# EAGLE design lightbird (EAGLE 8.4.3)
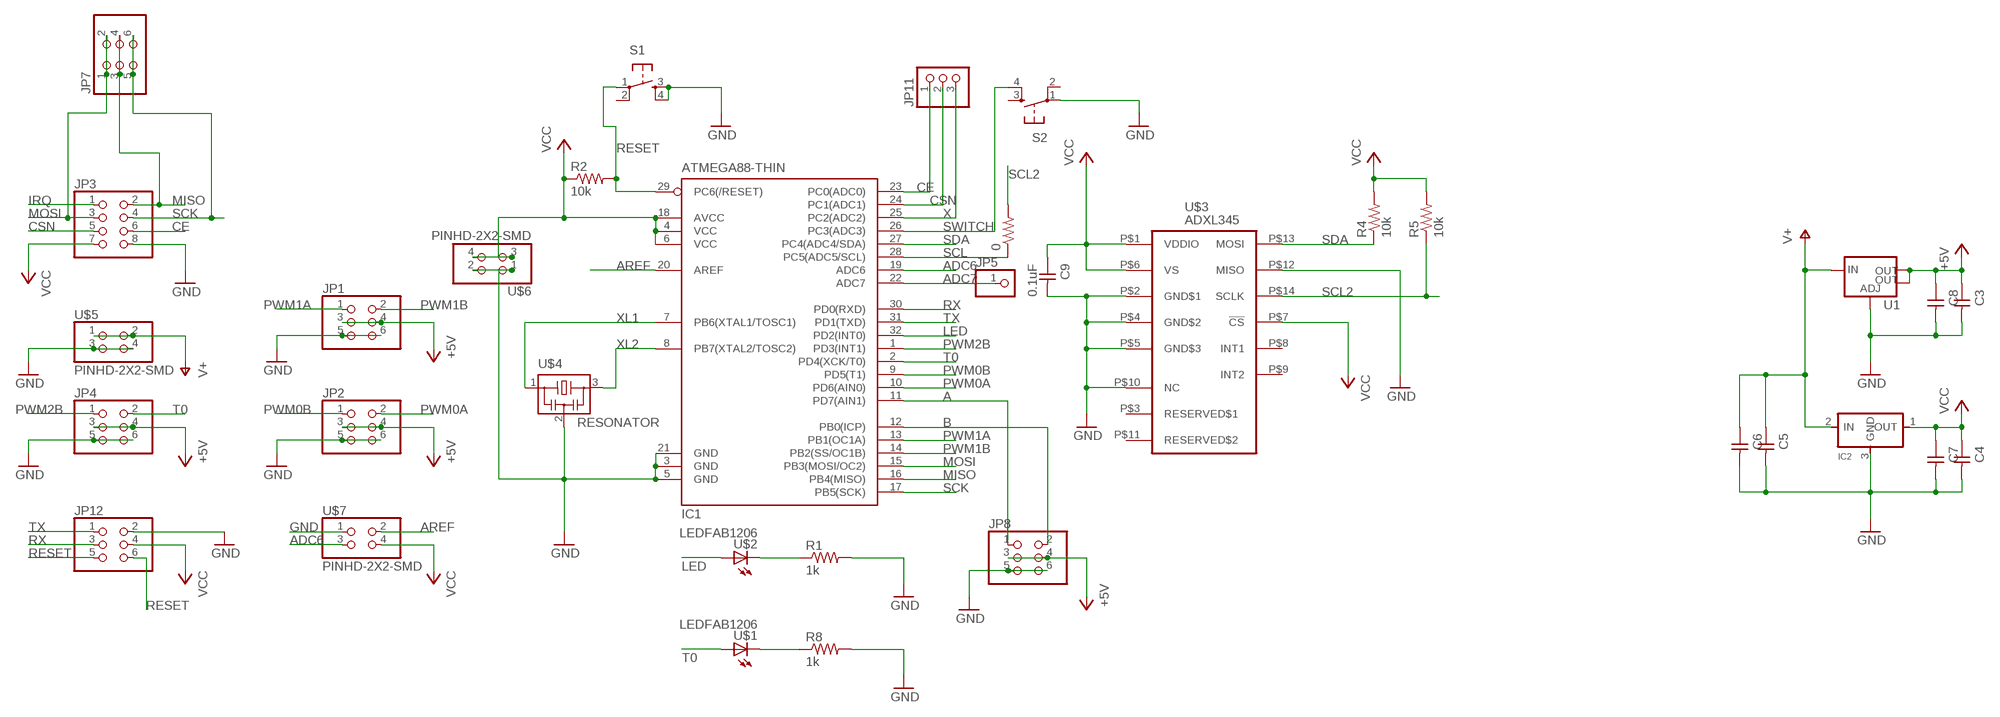
[diagram p0: schematic, sheet 1]

## Parts
0  RES-US1206FAB  [R1206FAB]
C3  CAP-UNPOLARIZEDFAB  [C1206FAB]
C4  CAP-UNPOLARIZEDFAB  [C1206FAB]
C5  CAP-UNPOLARIZEDFAB  [C1206FAB]
C6  CAP-UNPOLARIZEDFAB  [C1206FAB]
C7  CAP-UNPOLARIZEDFAB  [C1206FAB]
C8  CAP-UNPOLARIZEDFAB  [C1206FAB]
C9  0.1uF  CAP-UNPOLARIZEDFAB  [C1206FAB]
IC1  ATMEGA88-THIN  [TQFP32-08THIN]
IC2  REGULATORSOT23  [SOT23]
JP1  PINHD-2X3-SMD  [2X03SMD]
JP2  PINHD-2X3-SMD  [2X03SMD]
JP3  PINHD-2X4SMT  [2X04_SMT]
JP4  PINHD-2X3-SMD  [2X03SMD]
JP5  PINHD-1X1  [1X01]
JP7  PINHD-2X3-SMD  [2X03SMD]
JP8  PINHD-2X3-SMD  [2X03SMD]
JP11  PINHD-1X3  [1X03]
JP12  PINHD-2X3-SMD  [2X03SMD]
R1  1k  RES-US1206FAB  [R1206FAB]
R2  10k  RES-US1206FAB  [R1206FAB]
R4  10k  RES-US1206FAB  [R1206FAB]
R5  10k  RES-US1206FAB  [R1206FAB]
R8  1k  RES-US1206FAB  [R1206FAB]
S1  6MM_SWITCH6MM_SWITCH  [6MM_SWITCH]
S2  6MM_SWITCH6MM_SWITCH  [6MM_SWITCH]
U1  V_REG_LM1117SOT223  [SOT223]
U$1  LEDFAB1206  [LED1206FAB]
U$2  LEDFAB1206  [LED1206FAB]
U$3  ADXL345  [LGA14]
U$4  RESONATOR  [EFOBM]
U$5  PINHD-2X2-SMD  [2X02SMD]
U$6  PINHD-2X2-SMD  [2X02SMD]
U$7  PINHD-2X2-SMD  [2X02SMD]

## Nets
+5V: C3.1 C8.1 JP1.3 JP1.4 JP2.3 JP2.4 JP4.3 JP4.4 JP8.3 JP8.4 U1.2(OUT) U1.4(OUT)
A: IC1.11(PD7(AIN1)) JP8.1
ADC6: IC1.19(ADC6) U$7.3
ADC7: IC1.22(ADC7) JP5.1
AREF: IC1.20(AREF) U$7.2
B: IC1.12(PB0(ICP)) JP8.2
CE: IC1.23(PC0(ADC0)) JP3.6 JP11.1
CSN: IC1.24(PC1(ADC1)) JP3.5 JP11.2
GND: C3.2 C4.2 C5.2 C6.2 C7.2 C8.2 C9.2 IC1.3(GND) IC1.5(GND) IC1.21(GND) IC2.3(GND) JP1.5 JP1.6 JP2.5 JP2.6 JP3.8 JP4.5 JP4.6 JP8.5 JP8.6 JP12.2 R1.2 R8.2 S1.3(S) S1.4(S1) S2.1(P) U1.1(ADJ) U$3.P$2(GND$1) U$3.P$4(GND$2) U$3.P$5(GND$3) U$3.P$10(NC) U$3.P$12(MISO) U$4.2 U$5.3 U$5.4 U$6.1 U$6.2 U$7.1
IRQ: JP3.1
LED: IC1.32(PD2(INT0)) U$2.1(A)
MISO: IC1.16(PB4(MISO)) JP3.2 JP7.3 JP7.4
MOSI: IC1.15(PB3(MOSI/OC2)) JP3.3 JP7.1 JP7.2
N$2: R1.1 U$2.2(C)
N$3: R8.1 U$1.2(C)
PWM0A: IC1.10(PD6(AIN0)) JP2.2
PWM0B: IC1.9(PD5(T1)) JP2.1
PWM1A: IC1.13(PB1(OC1A)) JP1.1
PWM1B: IC1.14(PB2(SS/OC1B)) JP1.2
PWM2B: IC1.1(PD3(INT1)) JP4.1
RESET: IC1.29(PC6(/RESET)) JP12.5 JP12.6 R2.2 S1.1(P)
RX: IC1.30(PD0(RXD)) JP12.3
SCK: IC1.17(PB5(SCK)) JP3.4 JP7.5 JP7.6
SCL: 0.1 IC1.28(PC5(ADC5/SCL))
SCL2: 0.2 R5.1 U$3.P$14(SCLK)
SDA: IC1.27(PC4(ADC4/SDA)) R4.1 U$3.P$13(MOSI)
SWITCH: IC1.26(PC3(ADC3)) S2.4(S1)
T0: IC1.2(PD4(XCK/T0)) JP4.2 U$1.1(A)
TX: IC1.31(PD1(TXD)) JP12.1
V+: C5.1 C6.1 IC2.2(IN) U1.3(IN) U$5.1 U$5.2
VCC: C4.1 C7.1 C9.1 IC1.4(VCC) IC1.6(VCC) IC1.18(AVCC) IC2.1(OUT) JP3.7 JP12.4 R2.1 R4.2 R5.2 U$3.P$1(VDDIO) U$3.P$6(VS) U$3.P$7(!CS) U$6.3 U$6.4 U$7.4
X: IC1.25(PC2(ADC2)) JP11.3
XL1: IC1.7(PB6(XTAL1/TOSC1)) U$4.1
XL2: IC1.8(PB7(XTAL2/TOSC2)) U$4.3
Unconnected: S1.2(P1) S2.2(P1) S2.3(S) U$3.P$3(RESERVED$1) U$3.P$8(INT1) U$3.P$9(INT2) U$3.P$11(RESERVED$2)

## Library data of the parts
0 R1 R2 R4 R5 R8 = fab:RES-US: Resistor (US Symbol) Variants with postfix FAB are widened to allow the routing of internal traces
C3-C9 = fab:CAP-UNPOLARIZED
IC1 = fab:ATMEGA88-THIN
IC2 = fab:REGULATOR
JP1 JP2 JP4 JP7 JP8 JP12 = fab:PINHD-2X3-SMD: PIN HEADER
JP3 = pinhead+:PINHD-2X4: PIN HEADER
JP5 = pinhead:PINHD-1X1: PIN HEADER
JP11 = pinhead+:PINHD-1X3: PIN HEADER
S1 S2 = fab:6MM_SWITCH: OMRON SWITCH
U1 = fab:V_REG_LM1117: Voltage Regulator LM1117 Standard adjustable voltage regulator but in SMD form. Spark Fun Electronics SKU : COM-00595; PROD_ID: VREG-08170
U$1 U$2 = fab:LED: LED
U$3 = adxl345_small:ADXL345: 3-Axis, ±2 g/±4 g/±8 g/±16 g Digital Accelerometer
U$4 = fab:RESONATOR
U$5-U$7 = fab:PINHD-2X2-SMD

## Board
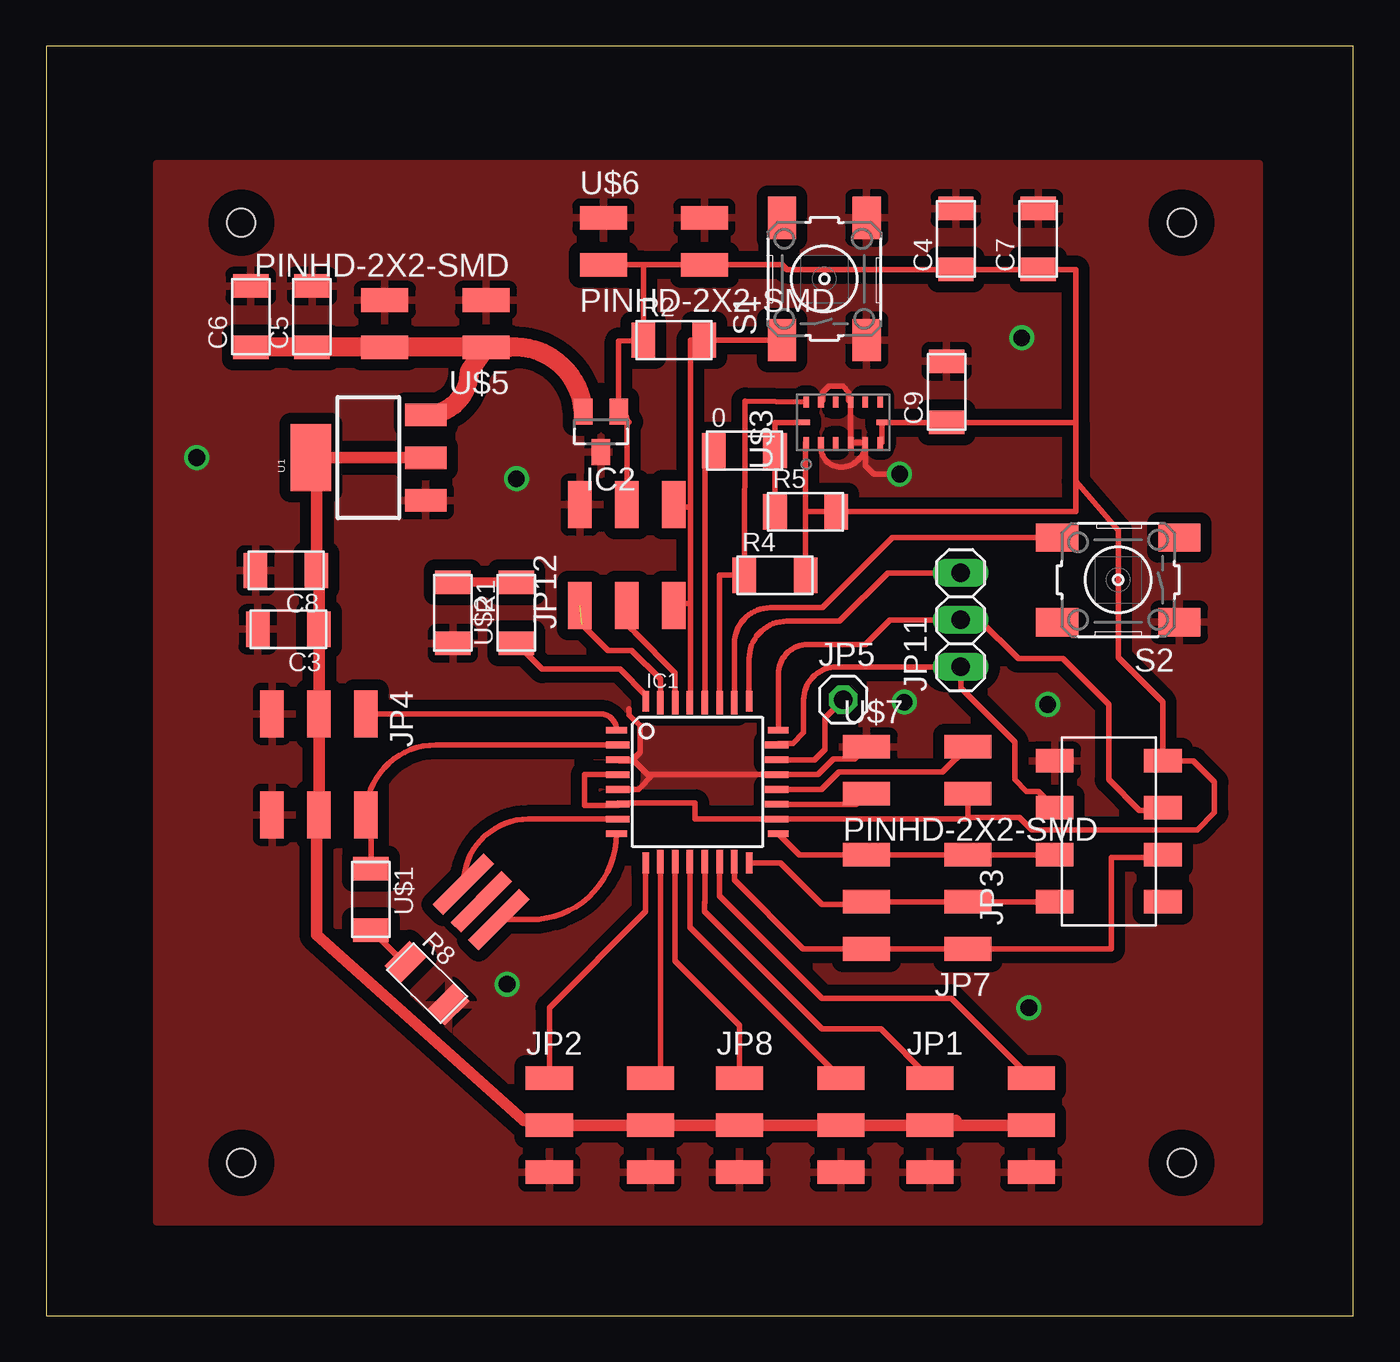
[diagram p1: board, top side]
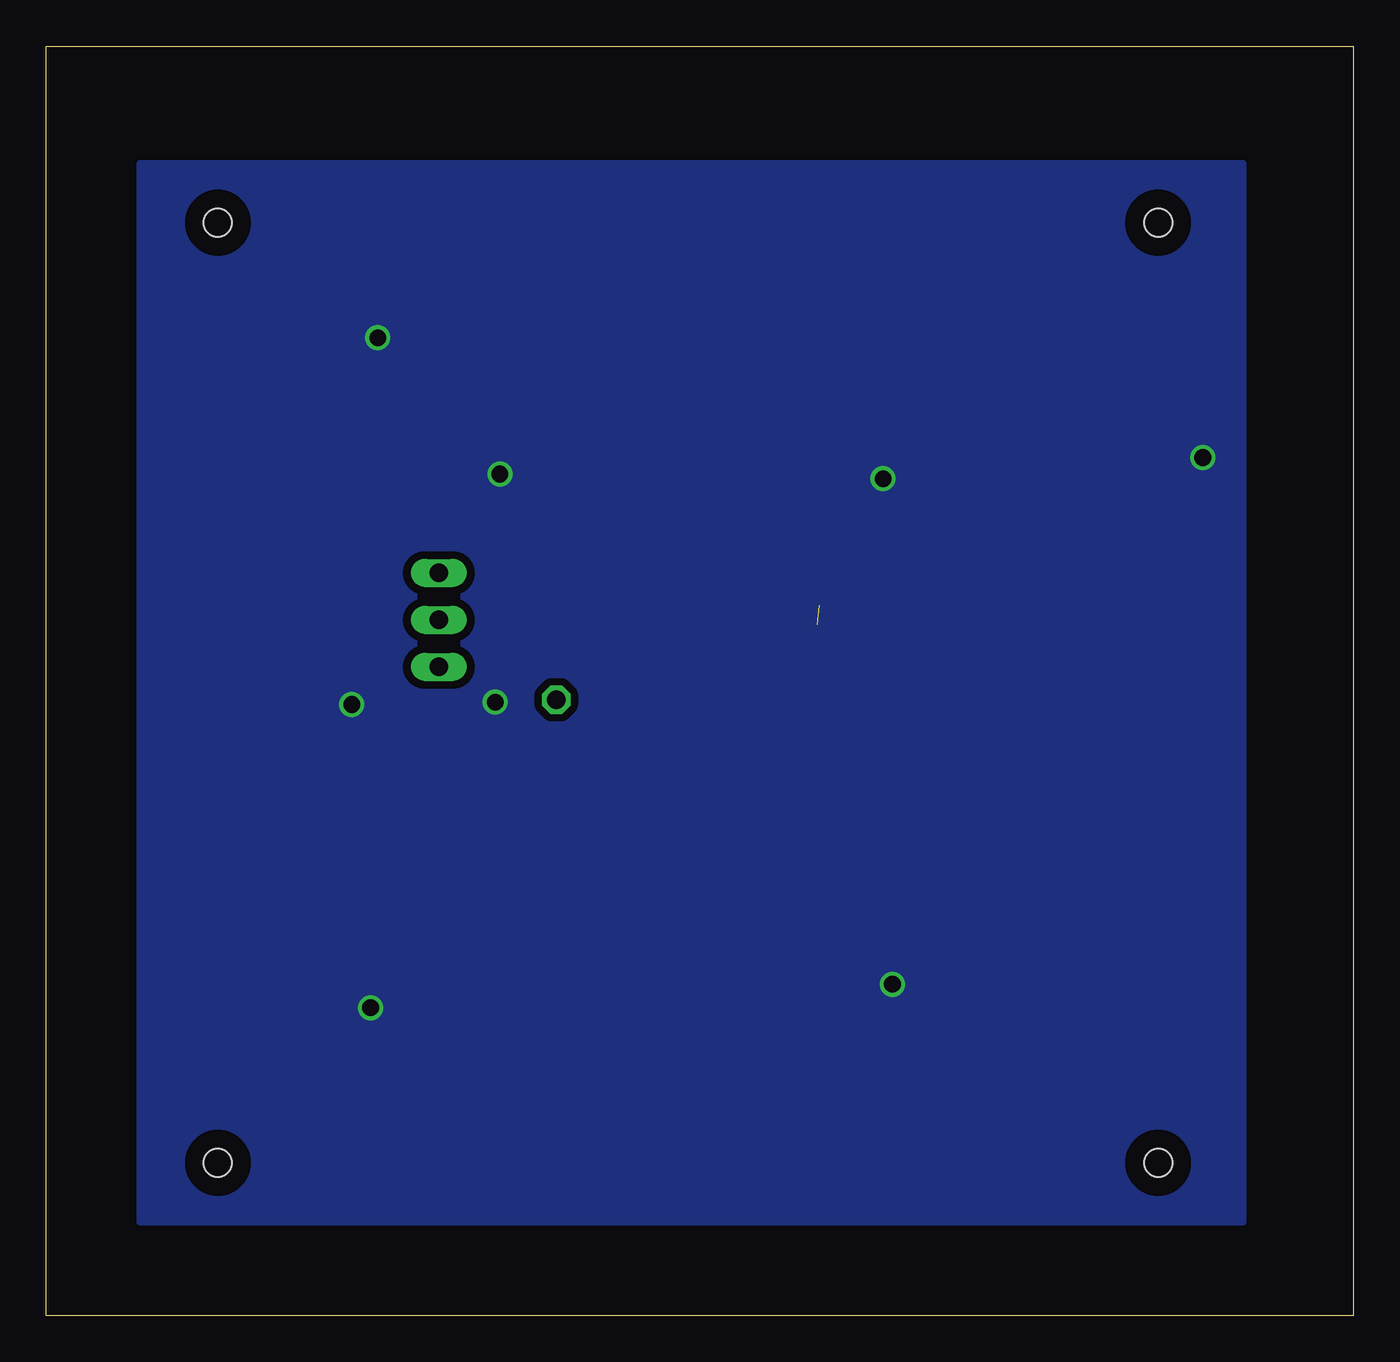
[diagram p2: board, bottom side, seen from below]

Size 70.61 x 68.58 mm. Coordinates in mm from the lower left corner, seen from the top.
Outline: 0,0 70.61,0 70.61,68.58 0,68.58 0,0
Copper layers (1*16): Top 0.035mm / dielectric 1.5mm / Bottom 0.035mm
Design rules "fab *": minimum track width 0.3mm, minimum drill 32mil, track to track 0.397mm, track to pad 0.397mm, pad to pad 0.397mm, via to via 0.397mm, smd to smd 0.397mm, copper to edge 40mil, drill to drill 16mil, minimum pad ring 10mil, minimum via ring 8mil, stop-mask expansion 4mil, vias tented up to drill 0mil, thermal gap 16mil
Holes 1.52 mm at 10.54,59.05 10.54,8.26 61.34,8.26 61.34,59.05

### Footprints (pad centres in the part's own frame; a part is rotated, then mirrored left to right if it is on the bottom)
R1206FAB = smd 1.27 x 1.905: 1 -1.651,0; 2 1.651,0
C1206FAB = smd 1.27 x 1.905: 1 -1.651,0; 2 1.651,0
TQFP32-08THIN = smd 1.118 x 0.356: 1 -4.369,2.8; 8 -4.369,-2.8; 17 4.369,-2.8; 24 4.369,2.8 | smd 1.27 x 0.356: 2 -4.293,2; 3 -4.293,1.2; 4 -4.293,0.4; 5 -4.293,-0.4; 6 -4.293,-1.2; 7 -4.293,-2; 18 4.293,-2; 19 4.293,-1.2; 20 4.293,-0.4; 21 4.293,0.4; 22 4.293,1.2; 23 4.293,2 | smd 0.356 x 1.118: 9 -2.8,-4.369; 16 2.8,-4.369; 25 2.8,4.369; 32 -2.8,4.369 | smd 0.356 x 1.27: 10 -2,-4.293; 14 1.2,-4.293; 15 2,-4.293; 26 2,4.293; 27 1.2,4.293; 31 -2,4.293 | smd 0.35 x 1.27: 11 -1.2,-4.293; 12 -0.4,-4.293; 13 0.4,-4.293; 28 0.4,4.293; 29 -0.4,4.293; 30 -1.2,4.293
SOT23 = smd 1 x 1.4: 1 -0.95,-1.1; 2 0.95,-1.1; 3 0,1.1
2X03SMD = smd 2.54 x 1.27: 1 -2.54,2.54; 2 2.92,2.54; 3 -2.54,0; 4 2.92,0; 5 -2.54,-2.54; 6 2.92,-2.54
2X04_SMT = smd 1.27 x 2.032: 1 -3.81,-2.921; 2 -3.81,2.921; 3 -1.27,-2.921; 4 -1.27,2.921; 5 1.27,-2.921; 6 1.27,2.921; 7 3.81,-2.921; 8 3.81,2.921
1X01 = drill 1.016 octagon: 1 0,0
1X03 = drill 1.016 long: 1 -2.54,0; 2 0,0; 3 2.54,0
6MM_SWITCH = smd 2.286 x 1.524: 1 -3.302,2.286; 2 3.302,2.286; 3 -3.302,-2.286; 4 3.302,-2.286
SOT223 = smd 1.219 x 2.235: 1 -2.311,-3.099; 2 0,-3.099; 3 2.311,-3.099 | smd 3.6 x 2.2: 4 0,3.099
LED1206FAB = smd 1.27 x 1.905: 1 -1.651,0; 2 1.651,0
LGA14 = smd 0.61 x 0.305: P$1 -1.1,2; P$2 -1.1,1.2; P$3 -1.1,0.4; P$4 -1.1,-0.4; P$5 -1.1,-1.2; P$6 -1.1,-2; P$8 1.1,-2; P$9 1.1,-1.2; P$10 1.1,-0.4; P$11 1.1,0.4; P$12 1.1,1.2; P$13 1.1,2 | smd 0.305 x 0.61: P$7 0,-2.1; P$14 0,2.1
EFOBM = smd 0.8 x 3.9: 1 -1.35,0; 2 0,0; 3 1.35,0
2X02SMD = smd 2.54 x 1.27: 1 -2.54,1.27; 2 2.92,1.27; 3 -2.54,-1.27; 4 2.92,-1.27

### Placement (x,y rotation side)
0  37.72,46.74 0 top
C3  13.08,37.08 180 top
C4  49.15,58.17 90 top
C5  14.35,53.98 90 top
C6  11.05,53.98 90 top
C7  53.59,58.17 90 top
C8  12.95,40.26 180 top
C9  48.64,49.91 90 top
IC1  35.18,28.83 0 top
IC2  29.97,47.75 180 top
JP1  50.29,10.29 0 top
JP2  29.72,10.29 0 top
JP3  57.4,26.16 90 top
JP4  14.73,29.97 270 top
JP5  43.05,33.27 0 top
JP7  47.24,22.35 180 top
JP8  40.01,10.29 0 top
JP11  49.4,37.59 90 top
JP12  31.37,40.89 90 top
R1  21.97,37.97 270 top
R2  33.91,52.7 0 top
R4  39.37,40.01 0 top
R5  41.02,43.43 0 top
R8  20.57,17.96 315 top
S1  42.04,56.01 90 top
S2  57.91,39.75 180 top
U1  17.4,46.35 90 top
U$1  17.54,22.49 270 top
U$2  25.4,37.97 90 top
U$3  43.05,48.26 90 top
U$4  23.5,22.35 315 top
U$5  21.21,53.59 180 top
U$6  32.64,58.04 0 top
U$7  46.86,29.46 0 top

### Tracks (layer width: path | path; a pad name or v marks a point on that pad's centre or on a via)
+5V
  Top 0.3: 14.73,45.92 U1.4 14.61,46.35 | JP4.4 14.87,26.86 14.61,26.59 | C8.1 14.73,40.26
  Top 0.61: JP4.4 JP4.3 C3.1 14.73,40.26 | U1.4 U1.2 | 14.61,26.59 14.61,20.57 25.78,10.54 JP2.3 JP2.4 JP8.3 JP8.4 JP1.3 | 14.61,46.35 C8.1 | 49.15,10.54 JP1.3 | JP1.3 JP1.4
A
  Top 0.3: IC1.11 33.98,19.18 37.47,15.69 JP8.1
ADC6
  Top 0.3: IC1.19 43.76,27.63 U$7.3
ADC7
  Top 0.3: IC1.22 41.51,30.03 42.06,30.58 42.06,32.28 JP5.1
AREF
  Top 0.3: U$7.2 48.42,29.38 42.83,29.38 41.88,28.43 IC1.20
B
  Top 0.3: IC1.12 34.78,20.97 JP8.2
CE
  Top 0.3: IC1.23 39.55,30.9 40.33,30.9 40.92,31.49 40.92,33.27 arc-90 42.7,35.05 JP11.1 49.4,33.91 52.32,30.99 52.32,28.96 52.96,28.32 53.59,28.32 JP3.6
CSN
  Top 0.3: JP3.5 60.2,27.3 59.05,27.3 57.4,28.96 57.4,33.02 54.93,35.5 52.51,35.5 50.42,37.59 JP11.2 45.59,37.59 44.26,36.26 41.15,36.26 arc90 39.55,34.66 IC1.24
GND  (via drill 0.9)
  Top 0.3: IC1.5 31.98,28.43 32.77,29.21 32.49,29.21 32.47,29.23 | U$3.P$5 44.25,45.92 44.7,45.47 v46.1,45.47 | U$3.P$2 41.85,46.92 arc90 42.93,45.85 42.94,45.85 arc90 U$3.P$5 | U$3.P$5 U$3.P$4 U$3.P$10 43.35,49.46 43.35,49.89 43.03,50.21 42.27,50.21 41.95,49.89 41.95,49.46 U$3.P$12 | 32.47,29.23 IC1.21 41.69,29.23 42.54,30.07 43.66,30.07 U$7.1 | 32.47,29.23 31.75,29.95 30.96,29.95 IC1.3 31.67,30.03 32.07,30.43 32.07,31.88 31.5,32.45 31.5,32.77
  other vias: 25.4,45.21 8.13,46.35 24.89,17.91 53.09,16.64 46.35,33.15 54.1,33.02 52.7,52.83
  pour Bottom (isolate 0.406): 65.53,62.23 5.97,62.23 5.97,5.08 65.53,5.08
  pour Top (isolate 0.61): 65.53,62.23 5.97,62.23 5.97,5.08 65.53,5.08
LED
  Top 0.3: IC1.32 32.38,33.53 30.99,34.92 26.8,34.92 U$2.1
MISO
  Top 0.3: IC1.16 39.67,24.46 41.91,22.23 44.2,22.23 JP7.4 JP7.3 JP3.2
MOSI
  Top 0.3: IC1.15 37.18,23.53 40.89,19.81 JP7.2 JP7.1 57.53,19.81 57.53,24.77 60.33,24.77 JP3.3
N$2
  Top 0.508: U$2.2 R1.1
N$3
  Top 0.3: R8.1 19.25,19.13 U$1.2
PWM0A
  Top 0.3: IC1.10 33.18,13.37 JP2.2
PWM0B
  Top 0.3: IC1.9 32.38,21.84 27.18,16.64 JP2.1
PWM1A
  Top 0.3: IC1.13 35.58,22.33 35.56,22.31 35.56,21.84 41.91,15.49 45.09,15.49 JP1.1
PWM1B
  Top 0.3: JP1.2 48.89,17.14 41.91,17.14 36.38,22.68 IC1.14
PWM2B
  Top 0.3: IC1.1 arc90 29.93,32.51 JP4.1
RESET
  Top 0.3: IC1.29 34.8,33.12 34.8,38.48 | 34.8,38.48 34.8,43.69 | 34.8,43.69 34.8,52.7 R2.2 S1.1 | 34.8,38.48 34.04,38.48 arc90 JP12.5 | 34.8,43.69 34.03,43.69 arc-90 JP12.6
RX
  Top 0.152: 31.81,36.89 31.81,37.91 JP12.3
  Top 0.3: IC1.30 33.98,34.73 31.81,36.89 31.5,37.21
SCK
  Top 0.3: JP3.4 JP7.5 JP7.6 40.69,24.89 IC1.17
SCL
  Top 0.3: 0.1 35.58,46.74 IC1.28
SCL2
  Top 0.3: R5.1 0.2 39.37,48.26 U$3.P$14
SDA
  Top 0.3: U$3.P$13 37.76,49.4 R4.1 36.38,40.01 IC1.27
SWITCH
  Top 0.3: S2.4 45.72,42.04 41.93,38.25 39.12,38.25 arc90 37.18,36.31 IC1.26
T0
  Top 0.3: IC1.2 21.05,30.83 arc90 JP4.2 17.54,26.78 U$1.1
TX  (1 unrouted)
  Top 0.3: 28.96,37.34 30.35,35.94 31.62,35.94 33.18,34.38 IC1.31
V+
  Top 1.016: U$5.1 U$5.2 C5.1 C6.1 | U1.3 arc90 22.86,51.03 U$5.1 | IC2.2 arc90 25.04,52.32 U$5.1
VCC
  Top 0.3: 31,48.78 31.5,48.28 | 31,48.78 IC2.1 30.92,52.64 R2.1 32.26,56.77 | IC1.4 29.08,29.23 29.08,27.56 30.89,27.56 IC1.6 30.89,27.69 35.05,27.69 35.05,26.83 IC1.18 49.69,26.83 49.78,26.92 | U$3.P$1 41.02,47.16 41.02,43.43 | 41.02,43.43 R4.2 | 41.02,43.43 R5.2 55.63,43.43 55.63,45.09 | U$3.P$6 45.15,47.16 U$3.P$7 C9.1 55.63,48.26 | 55.63,48.26 55.63,56.52 C7.1 C4.1 40.01,56.52 39.75,56.77 U$6.4 32.26,56.77 | 55.63,48.26 55.63,45.09 | 55.63,45.09 57.91,42.42 57.91,35.56 60.33,33.15 JP3.7 61.98,29.97 63.12,28.83 63.12,27.18 62.19,26.25 53.24,26.25 52.57,26.92 49.78,26.92 | JP12.4 31.37,48.41 arc90 31,48.78 | 32.26,56.77 U$6.3 | 49.78,26.92 U$7.4
X
  Top 0.3: IC1.25 37.97,35.49 arc-90 40.01,37.52 42.85,37.52 45.47,40.13 JP11.3
XL1
  Top 0.3: IC1.7 26.06,26.83 arc90 U$4.1
XL2
  Top 0.3: U$4.3 26.18,21.4 arc90 IC1.8